# EAGLE schematic Commlink_Interface_V4 (EAGLE 6.5.0)
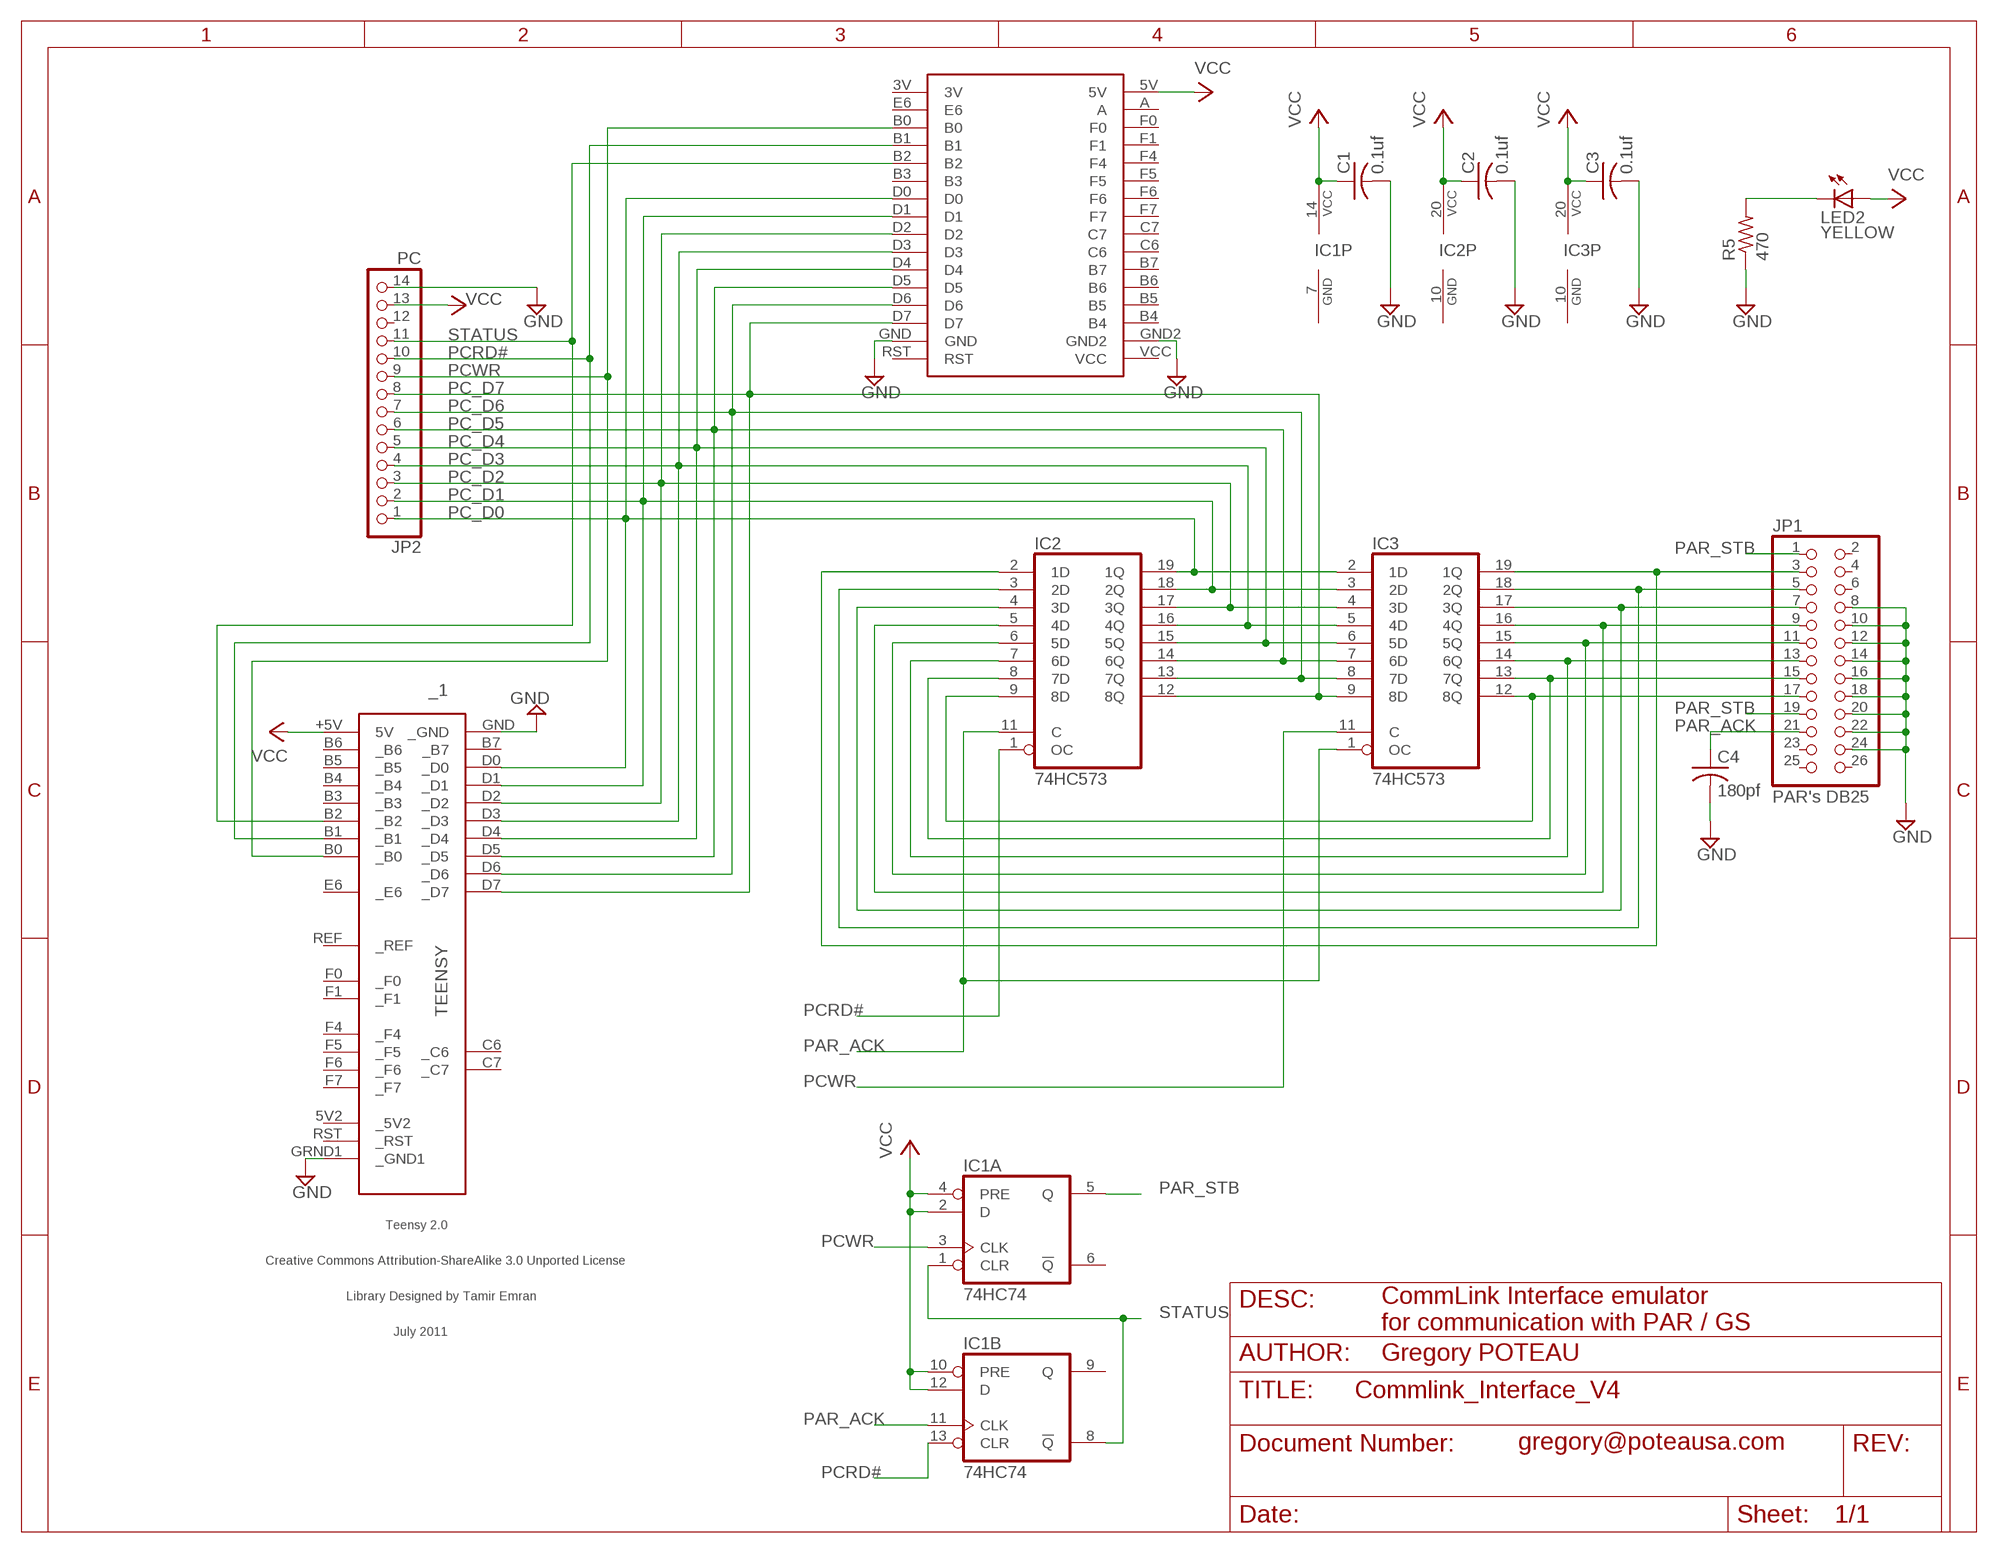
[diagram p0: schematic, sheet 1]

## Parts
_1  TEENSY  [TEENSY]
C1  0.1uf  C-US025-024X044  [C025-024X044]
C2  0.1uf  C-US025-024X044  [C025-024X044]
C3  0.1uf  C-US025-024X044  [C025-024X044]
C4  180pf  C-US025-024X044  [C025-024X044]
IC1  74HC74  74LS74N  [DIL14]
IC2  74HC573  74AS573N  [DIL20]
IC3  74HC573  74AS573N  [DIL20]
JP1  PAR's DB25  PINHD-2X13  [2X13]
JP2  PC  PINHD-1X14  [1X14]
LED2  YELLOW  LED3MM  [LED3MM]
R5  470  R-US_0207/5V  [0207/5V]
U$2  ATMEGA32U4BREAKOUTBOARDNO_HOLES  [ATMEGA32U4BREAKOUT]

## Nets
GND: _1.GND(_GND) _1.GRND1(_GND1) C1.2 C2.2 C3.2 C4.2 JP1.8 JP1.10 JP1.12 JP1.14 JP1.16 JP1.18 JP1.20 JP1.22 JP1.24 JP2.14 R5.1 U$2.GND U$2.GND2
N$2: LED2.K(C) R5.2
N$10: IC2.3(2D) IC3.18(2Q) JP1.5
N$11: IC2.4(3D) IC3.17(3Q) JP1.7
N$12: IC2.5(4D) IC3.16(4Q) JP1.9
N$13: IC2.6(5D) IC3.15(5Q) JP1.11
N$14: IC2.7(6D) IC3.14(6Q) JP1.13
N$15: IC2.8(7D) IC3.13(7Q) JP1.15
N$17: IC2.2(1D) IC3.19(1Q) JP1.3
N$18: IC2.9(8D) IC3.12(8Q) JP1.17
PAR_ACK: C4.1 IC1.11(B:CLK) IC2.11(C) IC3.1(OC) JP1.21
PAR_STB: IC1.5(A:Q) JP1.1 JP1.19
PC_D0: _1.D0(_D0) IC2.19(1Q) IC3.2(1D) JP2.1 U$2.D0
PC_D1: _1.D1(_D1) IC2.18(2Q) IC3.3(2D) JP2.2 U$2.D1
PC_D2: _1.D2(_D2) IC2.17(3Q) IC3.4(3D) JP2.3 U$2.D2
PC_D3: _1.D3(_D3) IC2.16(4Q) IC3.5(4D) JP2.4 U$2.D3
PC_D4: _1.D4(_D4) IC2.15(5Q) IC3.6(5D) JP2.5 U$2.D4
PC_D5: _1.D5(_D5) IC2.14(6Q) IC3.7(6D) JP2.6 U$2.D5
PC_D6: _1.D6(_D6) IC2.13(7Q) IC3.8(7D) JP2.7 U$2.D6
PC_D7: _1.D7(_D7) IC2.12(8Q) IC3.9(8D) JP2.8 U$2.D7
PCRD#: _1.B1(_B1) IC1.13(B:CLR) IC2.1(OC) JP2.10 U$2.B1
PCWR: _1.B0(_B0) IC1.3(A:CLK) IC3.11(C) JP2.9 U$2.B0
STATUS: _1.B2(_B2) IC1.1(A:CLR) IC1.8(B:!Q) JP2.11 U$2.B2
VCC: _1.+5V(5V) C1.1 C2.1 C3.1 IC1.2(A:D) IC1.4(A:PRE) IC1.10(B:PRE) IC1.12(B:D) IC1.14(P:VCC) IC2.20(VCC) IC3.20(VCC) JP2.13 LED2.A U$2.5V
Unconnected: _1.5V2(_5V2) _1.B3(_B3) _1.B4(_B4) _1.B5(_B5) _1.B6(_B6) _1.B7(_B7) _1.C6(_C6) _1.C7(_C7) _1.E6(_E6) _1.F0(_F0) _1.F1(_F1) _1.F4(_F4) _1.F5(_F5) _1.F6(_F6) _1.F7(_F7) _1.REF(_REF) _1.RST(_RST) IC1.6(A:!Q) IC1.9(B:Q) JP1.2 JP1.4 JP1.6 JP1.23 JP1.25 JP1.26 JP2.12 U$2.3V U$2.A U$2.B3 U$2.B4 U$2.B5 U$2.B6 U$2.B7 U$2.C6 U$2.C7 U$2.E6 U$2.F0 U$2.F1 U$2.F4 U$2.F5 U$2.F6 U$2.F7 U$2.RST U$2.VCC

## Notes on the sheet
- DESC:
- CommLink Interface emulator
  for communication with PAR / GS
- AUTHOR: | Gregory POTEAU
- gregory@poteausa.com

## Power pins joined to a net without a drawn wire
GND: IC1.7(P:GND) IC2.10(GND) IC3.10(GND)

## Library data of the parts
_1 = teensy:TEENSY: Teensy 2.0 Original Design by Clint Fisher Modified Design by Tamir Emran Licensed Under Creative Commons Attribution-ShareAlike 3.0 Unported (CC BY-SA 3.0)
C1-C4 = rcl:C-US: CAPACITOR, American symbol
IC1 = 74xx-us:74*74: Dual D type positive edge triggered FLIP FLOP, preset and clear
IC2 IC3 = 74xx-us:74*573: 8-bit D latch BUS DRIVER
JP1 = pinhead:PINHD-2X13: PIN HEADER
JP2 = pinhead:PINHD-1X14: PIN HEADER
LED2 = led:LED: LED OSRAM: - CHIPLED LG R971, LG N971, LY N971, LG Q971, LY Q971, LO R971, LY R971 LH N974, LH R974 LS Q976, LO Q976, LY Q976 LO Q996 - Hyper CHIPLED LW Q18S LB Q993, LB Q99A, LB R99A - SideLED LS A670, LO A670, LY A670, LG A670, LP A670 LB A673, LV A673, LT A673, LW A673 LH A674 LY A675 LS A676, LA A676, LO A676, LY A676, LW A676 LS A679, LY A679, LG A679 - Hyper Micro SIDELED® LS Y876, LA Y876, LO Y876, LY Y876 LT Y87S - SmartLED LW L88C, LW L88S LB L89C, LB L89S, LG L890 LS L89K, LO L89K, LY L89K LS L896, LA L896, LO L896, LY L896 - TOPLED LS T670, LO T670, LY T670, LG T670, LP T670 LSG T670, LSP T670, LSY T670, LOP T670, LYG T670 LG T671, LOG T671, LSG T671 LB T673, LV T673, LT T673, LW T673 LH T674 LS T676, LA T676, LO T676, LY T676, LB T676, LH T676, LSB T676, LW T676 LB T67C, LV T67C, LT T67C, LS T67K, LO T67K, LY T67K, LW E67C LS E67B, LA E67B, LO E67B, LY E67B, LB E67C, LV E67C, LT E67C LW T67C LS T679, LY T679, LG T679 LS T770, LO T770, LY T770, LG T770, LP T770 LB T773, LV T773, LT T773, LW T773 LH T774 LS E675, LA E675, LY E675, LS T675 LS T776, LA T776, LO T776, LY T776, LB T776 LHGB T686 LT T68C, LB T68C - Hyper Mini TOPLED® LB M676 - Mini TOPLED Santana® LG M470 LS M47K, LO M47K, LY M47K Source: http://www.osram.convergy.de LUXEON: - LUMILED® LXK2-PW12-R00, LXK2-PW12-S00, LXK2-PW14-U00, LXK2-PW14-V00 LXK2-PM12-R00, LXK2-PM12-S00, LXK2-PM14-U00 LXK2-PE12-Q00, LXK2-PE12-R00, LXK2-PE12-S00, LXK2-PE14-T00, LXK2-PE14-U00 LXK2-PB12-K00, LXK2-PB12-L00, LXK2-PB12-M00, LXK2-PB14-N00, LXK2-PB14-P00, LXK2-PB14-Q00 LXK2-PR12-L00, LXK2-PR12-M00, LXK2-PR14-Q00, LXK2-PR14-R00 LXK2-PD12-Q00, LXK2-PD12-R00, LXK2-PD12-S00 LXK2-PH12-R00, LXK2-PH12-S00 LXK2-PL12-P00, LXK2-PL12-Q00, LXK2-PL12-R00 Source: www.luxeon.com KINGBRIGHT: KA-3528ASYC Source: www.kingbright.com
R5 = rcl:R-US_: RESISTOR, American symbol
U$2 = atmega32u4breakout:ATMEGA32U4BREAKOUTBOARD